# Altium schematic sheet MMBT3906-2A1_MMBT3906-2A.schdoc
size 127 x 101 mm
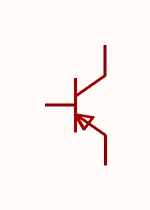
[diagram p0: MMBT3906-2A1_MMBT3906-2A.schdoc]

## Parts
Q?  MMBT3906  [SOT-23-3_L2.9-W1.3-P0.95-LS2.4-BR]  (value not drawn)

## Nets

Not connected (* = marked no-connect by the designer): Q? 1(B) 2(E) 3(C)

## Library data of the parts
Q? = MMBT3906_C364311: Manufacturer: MDD(辰达半导体); Symbol: MMBT3906-2A; Add into BOM: yes; type: PNP; Current - Collector(Ic): 200mA; Collector - Emitter Voltage VCEO: 40V; Pd - Power Dissipation: 200mW; DC Current Gain: 300@10mA,1V; Transition frequency(fT): 300MHz; Current - Collector Cutoff: 100nA; Vce Saturation(VCE(sat)): 300mV@50mA,5mA; Emitter-Base Voltage(Vebo): 5V; Number: 1个PNP; Device: MMBT3906_C364311; LCSC Part Name: PNP 电流:200mA 电压:40V; Supplier Part: C364311; Manufacturer Part: MMBT3906; Supplier Footprint: SOT-23; JLCPCB Part Class: Extended Part; Datasheet: https://item.szlcsc.com/datasheet/MMBT3906/338623.html; Supplier: LCSC; Convert to PCB: yes; Operating Temperature: -55℃~+150℃